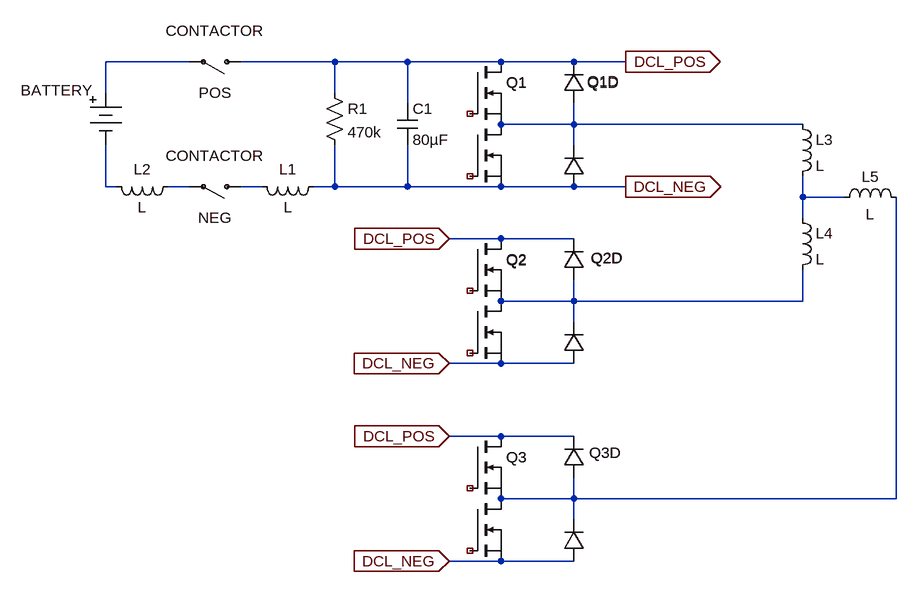
[diagram p0: schematic Draft1.asc]
Draft1.asc, the LTspice schematic file:
Version 4
SHEET 1 1252 904
WIRE 128 64 0 64
WIRE 352 64 208 64
WIRE 464 64 352 64
WIRE 608 64 464 64
WIRE 720 64 608 64
WIRE 800 64 720 64
WIRE 0 112 0 64
WIRE 352 112 352 64
WIRE 464 128 464 64
WIRE 720 160 720 128
WIRE 720 160 608 160
WIRE 1072 160 720 160
WIRE 720 192 720 160
WIRE 0 256 0 192
WIRE 16 256 0 256
WIRE 128 256 96 256
WIRE 240 256 208 256
WIRE 352 256 352 192
WIRE 352 256 320 256
WIRE 464 256 464 192
WIRE 464 256 352 256
WIRE 608 256 464 256
WIRE 720 256 608 256
WIRE 800 256 720 256
WIRE 1072 272 1072 240
WIRE 1136 272 1072 272
WIRE 1072 304 1072 272
WIRE 608 336 528 336
WIRE 720 336 608 336
WIRE 720 432 720 400
WIRE 720 432 608 432
WIRE 1072 432 1072 384
WIRE 1072 432 720 432
WIRE 720 464 720 432
WIRE 608 528 528 528
WIRE 720 528 608 528
WIRE 608 640 528 640
WIRE 720 640 608 640
WIRE 720 736 720 704
WIRE 720 736 608 736
WIRE 1216 736 1216 272
WIRE 1216 736 720 736
WIRE 720 768 720 736
WIRE 608 832 528 832
WIRE 720 832 608 832
FLAG 800 64 DCL_POS
IOPIN 800 64 Out
FLAG 528 336 DCL_POS
IOPIN 528 336 In
FLAG 528 640 DCL_POS
IOPIN 528 640 In
FLAG 800 256 DCL_NEG
IOPIN 800 256 Out
FLAG 528 528 DCL_NEG
IOPIN 528 528 In
FLAG 528 832 DCL_NEG
IOPIN 528 832 In
SYMBOL Misc\\battery 0 96 R0
WINDOW 0 -131 12 Left 2
SYMATTR InstName BATTERY
SYMATTR Value ""
SYMBOL csw 208 64 R90
WINDOW 0 -32 40 VBottom 2
WINDOW 3 32 40 VTop 2
SYMATTR InstName CONTACTOR
SYMATTR Value POS
SYMBOL csw 208 256 R90
WINDOW 0 -32 40 VBottom 2
WINDOW 3 32 40 VTop 2
SYMATTR InstName CONTACTOR
SYMATTR Value NEG
SYMBOL res 336 96 R0
SYMATTR InstName R1
SYMATTR Value 470k
SYMBOL cap 448 128 R0
SYMATTR InstName C1
SYMATTR Value 80µF
SYMBOL nmos 560 64 R0
SYMATTR InstName Q1
SYMATTR Value ""
SYMBOL nmos 560 160 R0
WINDOW 0 56 -65 Left 2
SYMATTR InstName Q1
SYMATTR Value ""
SYMBOL diode 736 128 R180
WINDOW 0 -54 34 Left 2
WINDOW 3 24 0 Left 2
SYMATTR InstName Q1D
SYMATTR Value ""
SYMBOL diode 736 256 R180
WINDOW 0 -54 160 Left 2
WINDOW 3 24 0 Left 2
SYMATTR InstName Q1D
SYMATTR Value ""
SYMBOL ind 336 240 R90
WINDOW 0 5 56 VBottom 2
WINDOW 3 32 56 VTop 2
SYMATTR InstName L1
SYMBOL ind 112 240 R90
WINDOW 0 5 56 VBottom 2
WINDOW 3 32 56 VTop 2
SYMATTR InstName L2
SYMBOL nmos 560 336 R0
SYMATTR InstName Q2
SYMATTR Value ""
SYMBOL nmos 560 432 R0
WINDOW 0 56 -63 Left 2
SYMATTR InstName Q2
SYMATTR Value ""
SYMBOL diode 736 400 R180
WINDOW 0 -59 34 Left 2
WINDOW 3 24 0 Left 2
SYMATTR InstName Q2D
SYMATTR Value ""
SYMBOL diode 736 528 R180
WINDOW 0 -60 163 Left 2
WINDOW 3 24 0 Left 2
SYMATTR InstName Q2D
SYMATTR Value ""
SYMBOL nmos 560 640 R0
SYMATTR InstName Q3
SYMATTR Value ""
SYMBOL nmos 560 736 R0
WINDOW 0 56 -64 Left 2
SYMATTR InstName Q3
SYMATTR Value ""
SYMBOL diode 736 704 R180
WINDOW 0 -57 39 Left 2
WINDOW 3 24 0 Left 2
SYMATTR InstName Q3D
SYMATTR Value ""
SYMBOL diode 736 832 R180
WINDOW 0 -57 167 Left 2
WINDOW 3 24 0 Left 2
SYMATTR InstName Q3D
SYMATTR Value ""
SYMBOL ind 1056 144 R0
SYMATTR InstName L3
SYMBOL ind 1056 288 R0
SYMATTR InstName L4
SYMBOL ind 1120 288 R270
WINDOW 0 32 56 VTop 2
WINDOW 3 5 56 VBottom 2
SYMATTR InstName L5

The netlist it stands for:
* Draft1.asc
V§BATTERY N001 N003
W§CONTACTOR DCL_POS N001 POS
W§CONTACTOR N005 N004 NEG
R1 DCL_POS DCL_NEG 470k
C1 DCL_POS DCL_NEG 80µF
M§Q1 DCL_POS NC_01 N002 N002
M§Q1 N002 NC_02 DCL_NEG DCL_NEG
D§Q1D N002 DCL_POS
D§Q1D DCL_NEG N002
L1 DCL_NEG N005 L
L2 N004 N003 L
M§Q2 DCL_POS NC_03 N007 N007
M§Q2 N007 NC_04 DCL_NEG DCL_NEG
D§Q2D N007 DCL_POS
D§Q2D DCL_NEG N007
M§Q3 DCL_POS NC_05 N008 N008
M§Q3 N008 NC_06 DCL_NEG DCL_NEG
D§Q3D N008 DCL_POS
D§Q3D DCL_NEG N008
L3 N002 N006 L
L4 N006 N007 L
L5 N006 N008 L
.model D D
.lib standard.dio
.model NMOS NMOS
.model PMOS PMOS
.lib standard.mos
.backanno
.end